# EAGLE design Fog_DRL_Cam (EAGLE 8.2.2)
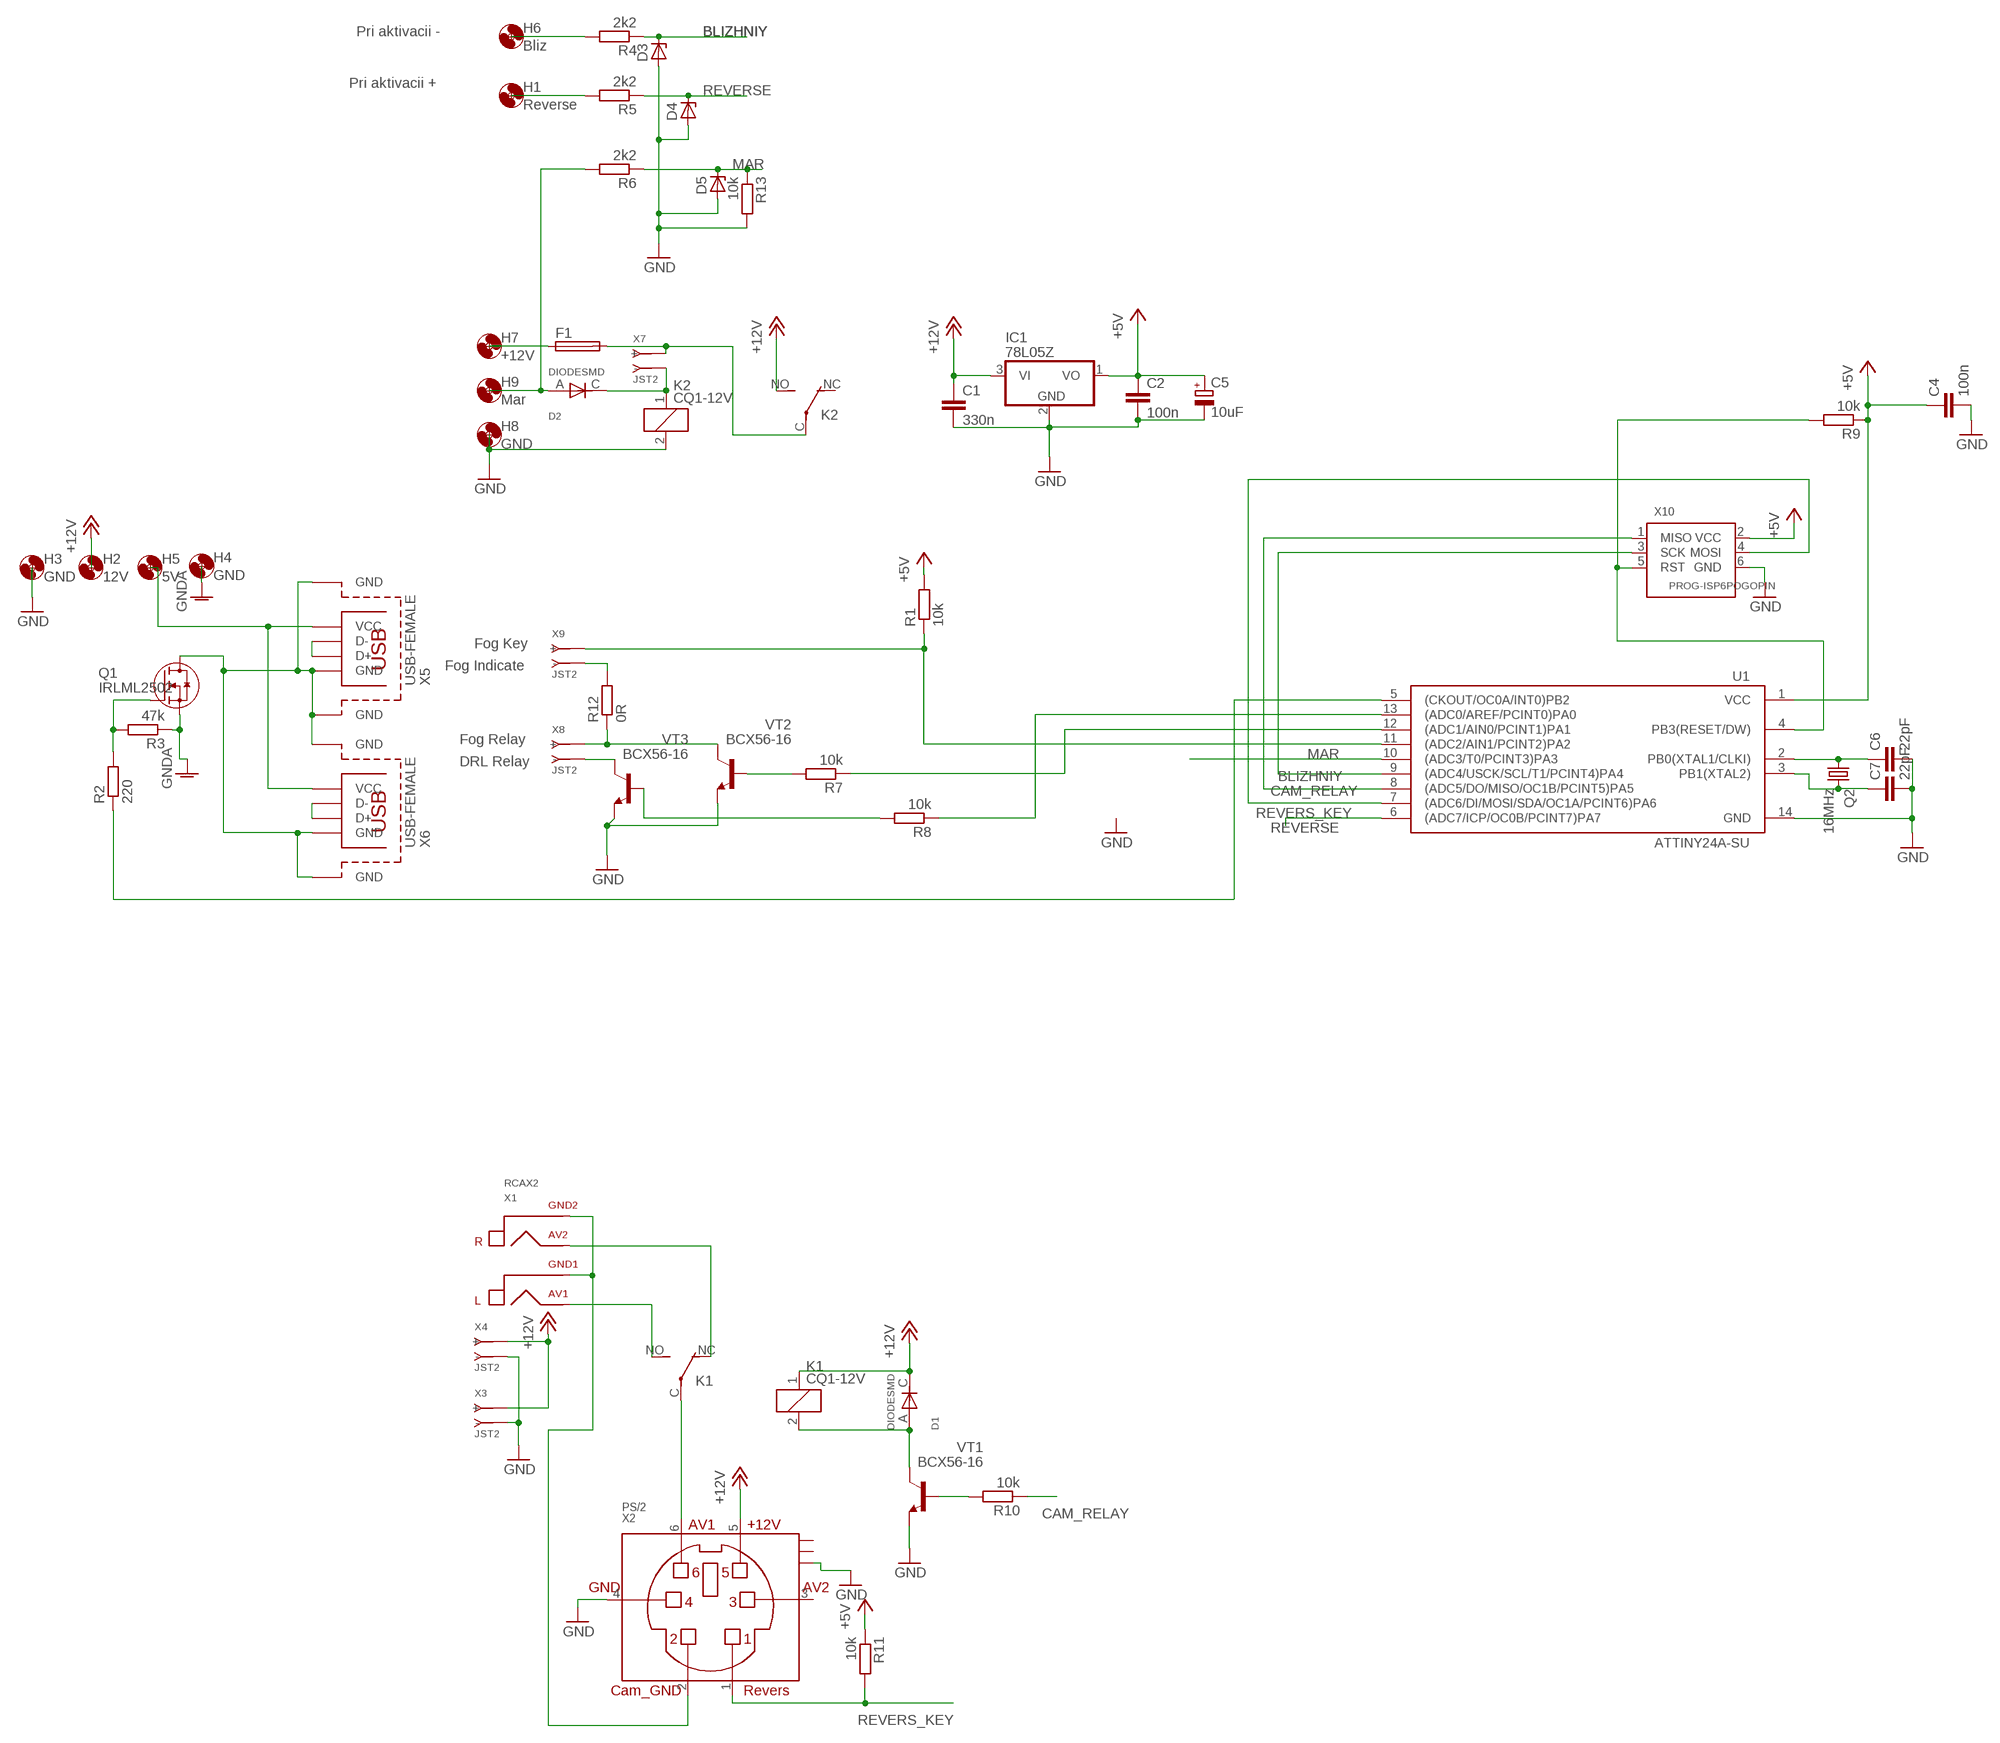
[diagram p0: schematic, sheet 1]

## Parts
C1  330n  C-EUC0805  [C0805]
C2  100n  C-EUC0603  [C0603]
C4  100n  C-EUC0603  [C0603]
C5  10uF  CPOL-EUCT3216  [CT3216]
C6  22pF  C-EUC0603  [C0603]
C7  22pF  C-EUC0603  [C0603]
D1  DIODESMD  [DO214AC]
D2  DIODESMD  [DO214AC]
D3  ZENER-DIODESOD80C  [SOD80C]
D4  ZENER-DIODESOD80C  [SOD80C]
D5  ZENER-DIODESOD80C  [SOD80C]
F1  SH22,5A  [SH22,5A]
H1  Reverse  MOUNT-HOLE2.8  [2,8]
H2  12V  MOUNT-HOLE3.0  [3,0]
H3  GND  MOUNT-HOLE3.0  [3,0]
H4  GND  MOUNT-HOLE3.0  [3,0]
H5  5V  MOUNT-HOLE3.0  [3,0]
H6  Bliz  MOUNT-HOLE2.8  [2,8]
H7  +12V  MOUNT-HOLE3.0  [3,0]
H8  GND  MOUNT-HOLE3.0  [3,0]
H9  Mar  MOUNT-HOLE2.8  [2,8]
IC1  78L05Z  [TO92]
K1  CQ1-12V  [CQ1]
K2  CQ1-12V  [CQ1]
Q1  IRLML2502  SI2302  [SOT-23-GSD]
Q2  16MHz  CRYSTALHC49UP  [HC49UP]
R1  10k  R-EU_R0603  [R0603]
R2  220  R-EU_R0603  [R0603]
R3  47k  R-EU_R0603  [R0603]
R4  2k2  R-EU_R0603  [R0603]
R5  2k2  R-EU_R0603  [R0603]
R6  2k2  R-EU_R0603  [R0603]
R7  10k  R-EU_R0603  [R0603]
R8  10k  R-EU_R0603  [R0603]
R9  10k  R-EU_R0603  [R0603]
R10  10k  R-EU_R0603  [R0603]
R11  10k  R-EU_R0603  [R0603]
R12  0R  R-EU_R0603  [R0603]
R13  10k  R-EU_R0603  [R0603]
U1  ATTINY24A-SU  [SO14]
VT1  BCX56-16  [SOT89-BCE]
VT2  BCX56-16  [SOT89-BCE]
VT3  BCX56-16  [SOT89-BCE]
X1  RCAX2  [RCAX2]
X2  PS/2  [PS/2]
X3  JST2  [JST*2]
X4  JST2  [JST*2]
X5  USB-FEMALE  [USB-FEMALE]
X6  USB-FEMALE  [USB-FEMALE]
X7  JST2  [JST*2]
X8  JST2  [JST*2]
X9  JST2  [JST*2]
X10  PROG-ISP6POGOPIN  [PROG_POGOPIN]

## Nets
+5V: C2.1 C4.1 C5.+ IC1.1(VO) R1.2 R9.1 R11.1 U1.1(VCC) X10.2(VCC)
+12V: C1.1 D1.C(KATOD) H2.P$1 IC1.3(VI) K1.1 K2.NO(2:S) X2.5 X3.1(+) X4.1(+)
BLIZHNIY: D3.C R4.1 U1.9((ADC4/USCK/SCL/T1/PCINT4)PA4) X10.3(SCK)
CAM_RELAY: R10.1 U1.8((ADC5/DO/MISO/OC1B/PCINT5)PA5) X10.1(MISO)
GND: C1.2 C2.2 C4.2 C5.- C6.2 C7.2 D3.A D4.A D5.A H3.P$1 H8.P$1 IC1.2(GND) K2.2 R13.2 U1.14(GND) VT1.E VT2.E VT3.E X2.4 X2.GND0 X3.2(-) X4.2(-) X10.6(GND)
GNDA: H4.P$1 Q1.S R3.1
MAR: D5.C R6.1 R13.1 U1.10((ADC3/T0/PCINT3)PA3)
N$1: K1.NO(2:S) X1.AV1
N$2: R12.2 X9.2(-)
N$3: X1.GND1 X1.GND2 X2.2
N$4: K1.C(2:P) X2.6
N$5: D1.A(ANOD) K1.2 VT1.C VT1.C@1(C)
N$6: F1.1 H7.P$1
N$7: H5.P$1 X5.VCC X6.VCC
N$8: Q1.D X5.GND X5.GND@1(GND) X5.GND@2(GND) X6.GND X6.GND@1(GND) X6.GND@2(GND)
N$9: X5.D+ X5.D-
N$10: X6.D+ X6.D-
N$11: F1.2 K2.C(2:P) X7.1(+)
N$12: D2.C(KATOD) K2.1 X7.2(-)
N$13: D2.A(ANOD) H9.P$1 R6.2
N$14: R2.1 U1.5((CKOUT/OC0A/INT0)PB2)
N$15: VT3.C VT3.C@1(C) X8.2(-)
N$16: R12.1 VT2.C VT2.C@1(C) X8.1(+)
N$17: R8.1 U1.13((ADC0/AREF/PCINT0)PA0)
N$18: R7.1 U1.12((ADC1/AIN0/PCINT1)PA1)
N$19: R1.1 U1.11((ADC2/AIN1/PCINT2)PA2) X9.1(+)
N$20: Q1.G R2.2 R3.2
N$21: H1.P$1 R5.2
N$22: H6.P$1 R4.2
N$25: R7.2 VT2.B
N$26: R8.2 VT3.B
N$27: C6.1 Q2.1 U1.2(PB0(XTAL1/CLKI))
N$28: R10.2 VT1.B
N$31: K1.NC(2:O) X1.AV2
N$38: R9.2 U1.4(PB3(RESET/DW)) X10.5(RST)
N$39: C7.1 Q2.2 U1.3(PB1(XTAL2))
REVERS_KEY: R11.2 U1.7((ADC6/DI/MOSI/SDA/OC1A/PCINT6)PA6) X2.1 X10.4(MOSI)
REVERSE: D4.C R5.1 U1.6((ADC7/ICP/OC0B/PCINT7)PA7)
Unconnected: K2.NC(2:O) X2.3 X2.GND1 X2.GND2

## Notes on the sheet
- Pri aktivacii -
- Pri aktivacii +
- Fog Key
- Fog Indicate
- Fog Relay
- DRL Relay

## Library data of the parts
C1 C2 C4 C6 C7 = rcl:C-EU: CAPACITOR, European symbol
C5 = rcl:CPOL-EU: POLARIZED CAPACITOR, European symbol
D1 D2 = usb:DIODE: DIODE
D3-D5 = diode:ZENER-DIODE: Z-Diode
F1 = fuse:SH22,5A: FUSE HOLDER grid 22,5mm, isolated cap OGN0031 8201, Schurter (Buerklin); MPN: 0031.7701.11; OC_FARNELL: unknown; OC_NEWARK: 04F1224
H1-H9 = holes:MOUNT-HOLE: MOUNTING HOLE with drill center marker
IC1 = linear:78*: Positive VOLTAGE REGULATOR Source: http://cache.national.com/ds/LM/LM78L05.pdf http://www.fairchildsemi.com/ds/LM/LM7805.pdf
K1 K2 = relay:CQ1-12V: AUTOMOTIVE QUIET RELAY NAiS Source: http://www.mew-europe.com/.. en_ds_61208_0000.pdf; OC_FARNELL: unknown; OC_NEWARK: unknown
Q1 = usb:SI2302: N-канальный полевик
Q2 = crystal:CRYSTAL: CRYSTAL; OC_FARNELL: unknown; OC_NEWARK: unknown
R1-R13 = rcl:R-EU_: RESISTOR, European symbol
U1 = usb:ATTINY24A: ATTiny24A ATTiny44A ATTiny84A
VT1-VT3 = usb:BCX56-16
X1 = usb:RCAX2
X2 = usb:PS/2: MINI DIN JACK DIP 90° WITH SHIELD
X3 X4 X7-X9 = usb:JST*2
X5 X6 = usb:USB: USB Port
X10 = usb:PROG-ISP

## Board
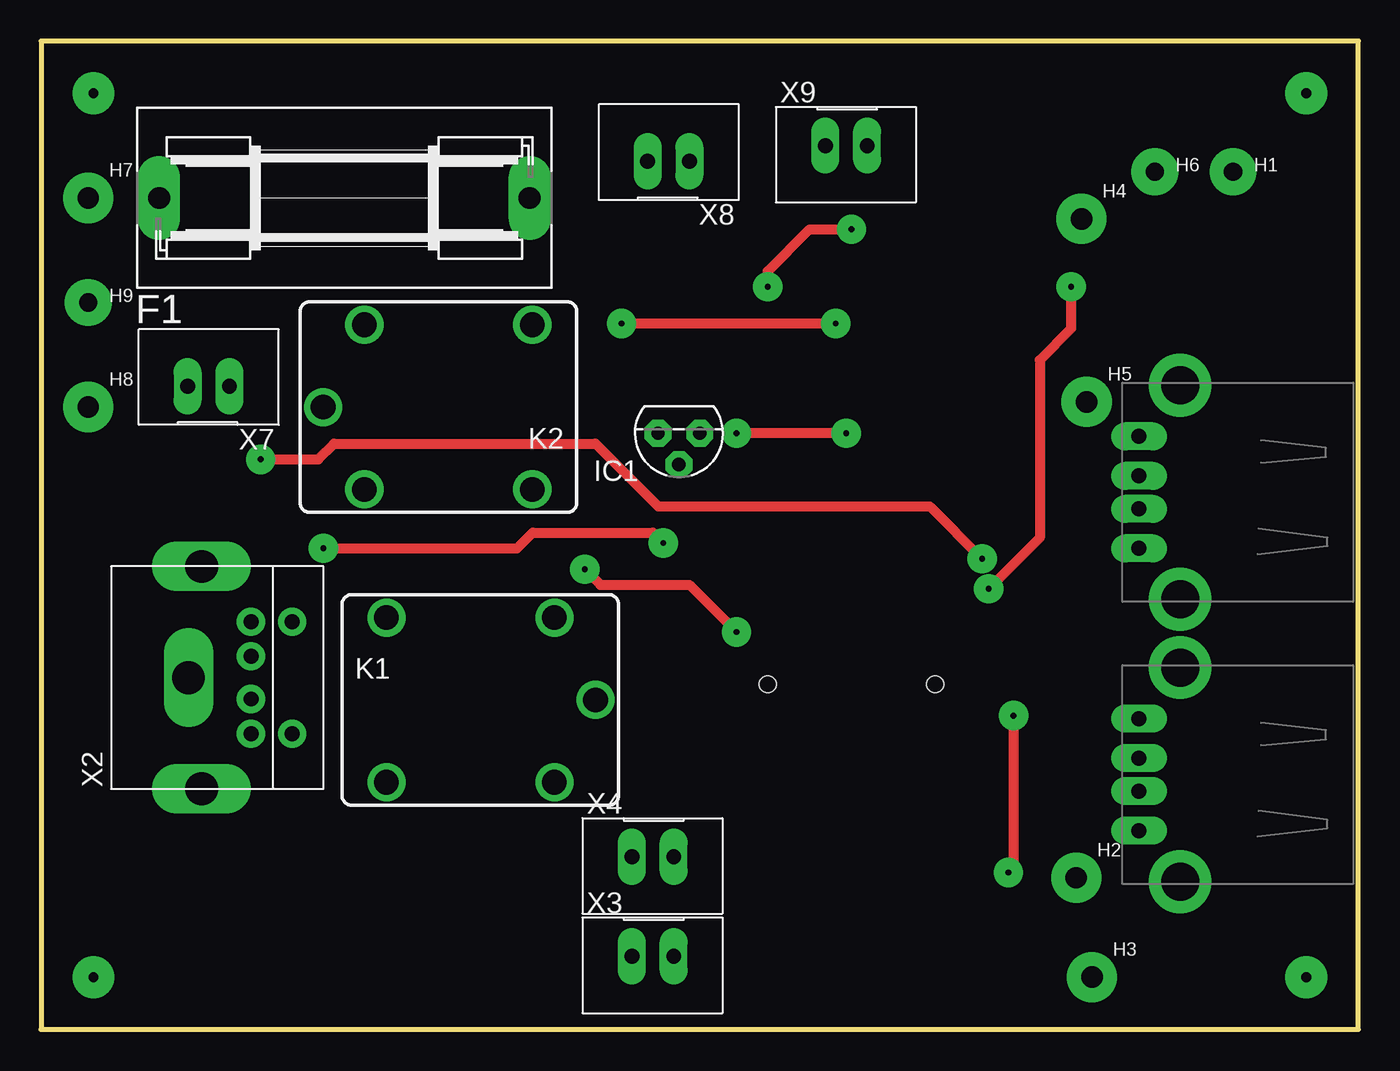
[diagram p1: board, top side]
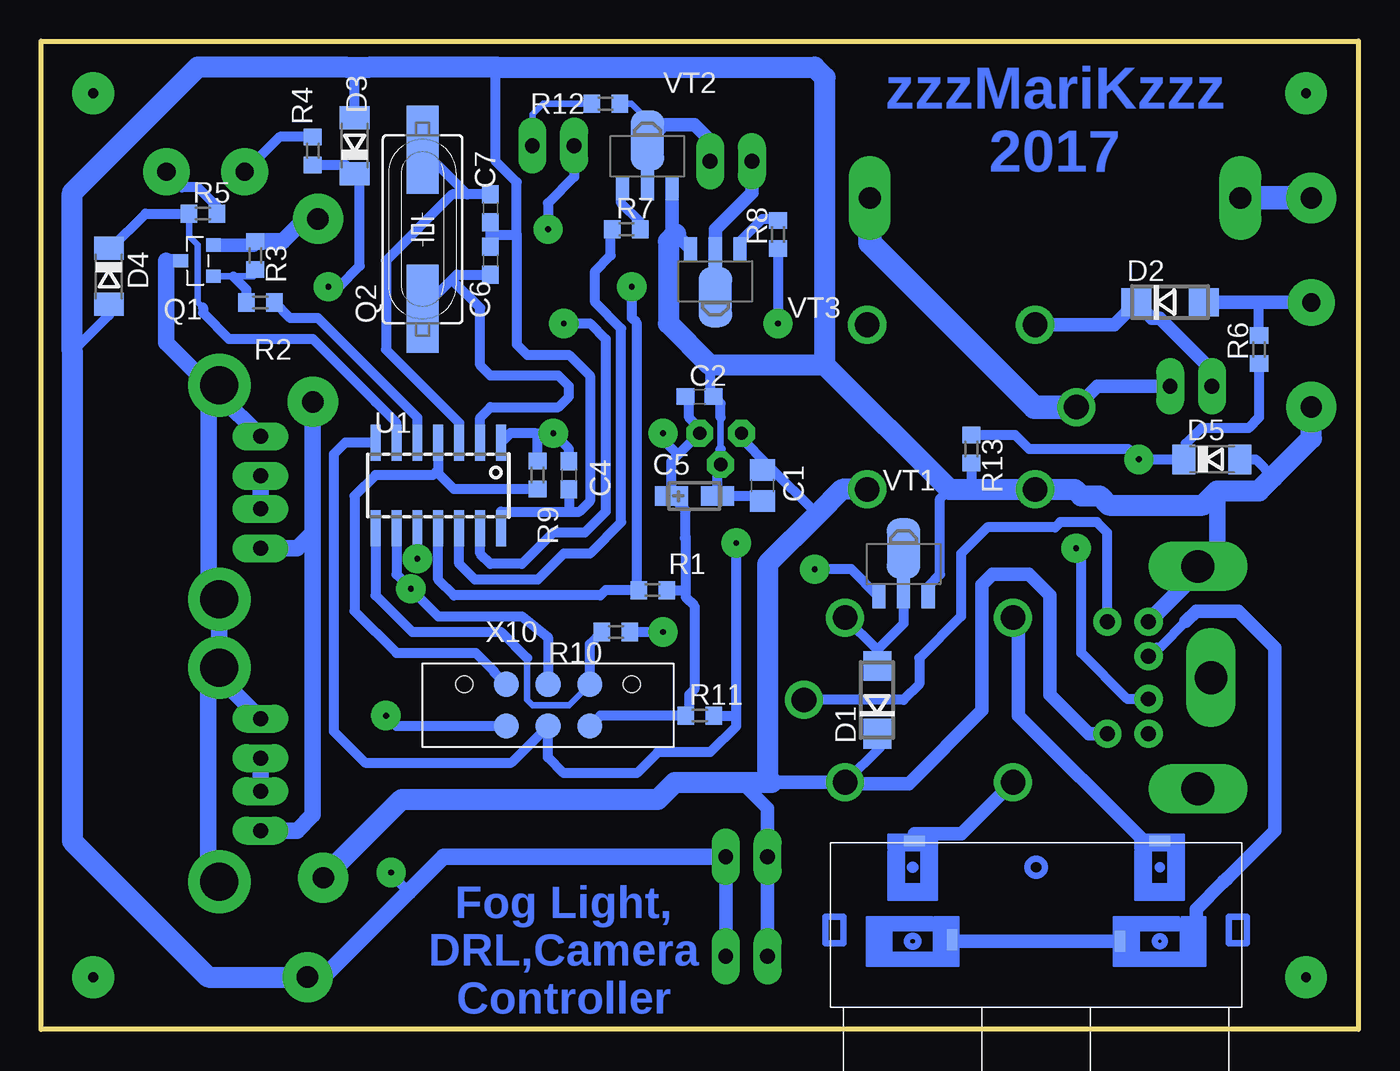
[diagram p2: board, bottom side, seen from below]

Size 80 x 60 mm. Coordinates in mm from the lower left corner, seen from the top.
Outline: 0,0 80,0 80,60 0,60 0,0
Copper layers (1*16): Top 0.035mm / dielectric 1.5mm / Bottom 0.035mm
Design rules "default": minimum track width 12mil, minimum drill 32mil, track to track 12mil, track to pad 12mil, pad to pad 12mil, via to via 12mil, smd to smd 8mil, copper to edge 40mil, drill to drill 8mil, minimum pad ring 16mil, minimum via ring 12mil, stop-mask expansion 4mil, vias tented up to drill 0mil, thermal gap 20mil

### Footprints (pad centres in the part's own frame; a part is rotated, then mirrored left to right if it is on the bottom)
C0805 = smd 1.3 x 1.5: 1 -0.95,0; 2 0.95,0
C0603 = smd 1.1 x 1: 1 -0.85,0; 2 0.85,0
CT3216 = smd 2 x 1.2: + -1.4,0; - 1.4,0
DO214AC = smd 1.8 x 1.7: A 2.05,0; C -2.05,0
SOD80C = smd 1.4 x 1.8: A 1.7,0; C -1.7,0
SH22,5A = drill 1.321 pad 2.54 long: 1 -11.252,0; 2 11.252,0
2,8 = drill 1.1 pad 2.845: P$1 0,0
3,0 = drill 1.3 pad 3.048: P$1 0,0
TO92 = drill 0.813 octagon: 1 -1.27,0; 2 0,1.905; 3 1.27,0
CQ1 = drill 1.5: 1 4.5,-5; 2 4.5,5; C 7,0; NC -5.7,-5; NO -5.7,5
SOT-23-GSD = smd 0.8 x 0.9: D 0,2; G -0.95,0; S 0.95,0
HC49UP = smd 5.334 x 1.93: 1 -4.826,0; 2 4.826,0
R0603 = smd 1 x 1.1: 1 -0.85,0; 2 0.85,0
SO14 = smd 0.6 x 2.2: 1 -3.81,-2.6; 2 -2.54,-2.6; 3 -1.27,-2.6; 4 0,-2.6; 5 1.27,-2.6; 6 2.54,-2.6; 7 3.81,-2.6; 8 3.81,2.6; 9 2.54,2.6; 10 1.27,2.6; 11 0,2.6; 12 -1.27,2.6; 13 -2.54,2.6; 14 -3.81,2.6
SOT89-BCE = smd 0.8 x 1.4: B -1.499,-1.981; E 1.499,-1.981 | smd 0.8 x 1.9: C 0,-1.727 | smd 2.032 x 3.65: C@1 0,0.94
RCAX2 = smd 1.27 x 0.635: AV1 0,-1.6; AV2 14.9,-1.6 | smd 0.635 x 1.27: GND1 2.4,4.5; GND2 12.6,4.4
PS/2 = drill 0.9: 1 5.45,4.4; 2 8.05,4.4; 3 3.35,4.4; 4 10.15,4.4; 5 3.35,1.9; 6 10.15,1.9 | drill 2 long: GND0 13.5,7.4; GND1 0,7.4; GND2 6.75,8.2
JST*2 = drill 0.9 long: 1 0,0; 2 2.54,0
USB-FEMALE = drill 0.9 long: D+ 4.4,0; D- 2.4,0; GND 6.8,0; VCC 0,0 | drill 2.3 pad 3.81: GND@1 -3.1,-2.5; GND@2 9.9,-2.5
PROG_POGOPIN = smd 1.524 x 1.524: 1 0,7.62; 2 2.54,7.62; 3 0,5.08; 4 2.54,5.08; 5 0,2.54; 6 2.54,2.54 | hole 1.016: 0,0; 0,10.16

### Placement (x,y rotation side)
C1  36.2,33.02 270 bottom
C2  40.01,38.42 0 bottom
C4  47.94,33.66 270 bottom
C5  40.32,32.38 0 bottom
C6  52.7,46.67 90 bottom
C7  52.7,49.85 270 bottom
D1  29.21,20 90 bottom
D2  11.43,44.13 0 bottom
D3  60.96,53.66 90 bottom
D4  75.88,45.72 270 bottom
D5  8.89,34.61 0 bottom
F1  18.41,50.48 0 top
H1  72.39,52.07 0 top
H2  62.87,9.21 0 top
H3  63.82,3.17 0 top
H4  63.18,49.21 0 top
H5  63.5,38.1 0 top
H6  67.63,52.07 0 top
H7  2.86,50.48 0 top
H8  2.86,37.78 0 top
H9  2.86,44.13 0 top
IC1  38.73,36.2 180 top
K1  26.67,20 0 top
K2  24.13,37.78 180 top
Q1  69.53,46.67 90 bottom
Q2  56.83,48.58 90 bottom
R1  42.86,26.67 0 bottom
R2  66.67,44.13 180 bottom
R3  66.99,46.99 270 bottom
R4  63.5,53.34 90 bottom
R5  70.17,49.53 0 bottom
R6  6.03,41.27 90 bottom
R7  44.45,48.58 0 bottom
R8  35.24,48.26 90 bottom
R9  49.85,33.66 270 bottom
R10  45.09,24.13 0 bottom
R11  40.01,19.05 0 bottom
R12  45.72,56.2 180 bottom
R13  23.5,35.24 270 bottom
U1  55.88,33.02 180 bottom
VT1  27.62,28.26 0 bottom
VT2  43.18,53.02 0 bottom
VT3  39.05,45.4 180 bottom
X1  12.06,9.84 180 bottom
X2  17.14,14.61 90 top
X3  35.88,4.45 0 top
X4  35.88,10.48 0 top
X5  66.67,12.06 90 top
X6  66.67,29.21 90 top
X7  11.43,39.05 180 top
X8  39.37,52.7 180 top
X9  47.62,53.66 0 top
X10  54.29,20.95 270 bottom

### Tracks (layer width: path | path; a pad name or v marks a point on that pad's centre or on a via)
+5V  (via drill 0.35 pad 1.78)
  Top 0.61: v48.9,36.2 v42.23,36.2
  Bottom 0.61: C2.1 40.64,38.2 40.64,37.15 40.01,36.51 IC1.1 41.32,34.88 | C5.+ 41.72,34.48 41.32,34.88 | C5.+ 41.72,32.26 | 50.03,36.2 51.49,36.2 U1.1 | 50.03,36.2 v48.9,36.2 47.94,35.24 C4.1 | R9.1 49.85,36.02 50.03,36.2 | 40.96,19.05 46.04,19.05 X10.2 | 40.96,19.05 R11.1 | 40.85,29.9 40.85,26.62 | 40.85,29.9 40.85,31.52 C5.+ | v42.23,36.2 42.23,35.79 41.32,34.88 | 40.91,29.84 40.85,29.9 | R1.2 40.9,26.67 40.85,26.62 | 40.85,26.62 40.85,26.25 40.32,25.72 40.32,20.64 40.64,20.32 40.64,19.37 40.96,19.05
+12V
  Bottom 0.61: 29.04,17.78 29.04,17.14 K1.1 | IC1.3 37.47,35.88 35.88,34.29 | 35.88,34.29 32.86,31.27 | C1.1 35.88,34.29
  Bottom 0.813: 35.88,15.24 35.64,15 K1.1 31.09,14.92 27.3,14.92 22.86,19.37 22.86,26.99 22.23,27.62 20,27.62 18.73,26.35 18.73,20.32 16.37,17.95 X2.5 | 29.04,17.78 D1.C | X3.1 X4.1 35.88,13.41 37.47,15
  Bottom 1.27: K2.NO 31.35,32.78 32.86,31.27 35.88,28.26 35.88,15.24 | 35.64,15 37.47,15 41.51,15 42.55,13.97 58.1,13.97 H2.P$1
BLIZHNIY  (via drill 0.35 pad 1.78)
  Top 0.61: v62.55,45.09 62.55,42.55 60.64,40.64 60.64,29.84 v57.55,26.75
  Bottom 0.61: U1.9 58.42,27.62 v57.55,26.75 55.88,25.08 50.8,25.08 49.21,23.81 X10.3 | R4.1 61.49,52.49 D3.C 60.64,51.64 60.64,46.35 61.91,45.09 v62.55,45.09
CAM_RELAY
  Bottom 0.406: 50.48,22.54 50.48,20 50.16,19.68 47.94,19.68 X10.1
  Bottom 0.61: U1.8 59.69,26.35 57.47,24.13 52.07,24.13 50.48,22.54 | X10.1 46.67,23.39 R10.1
GND  (via drill 0.35 pad 1.78)
  Top 0.61: v59.05,19.05 59.05,9.84 v58.74,9.53
  Bottom 0.406: 38.73,35.24 38.73,37.15
  Bottom 0.61: 38.73,35.24 IC1.2 38.92,34.1 C5.- 36.51,32.38 C1.2 | 38.73,37.15 38.73,38 C2.2 39.37,38.63 39.37,40.32 | U1.14 52.07,31.43 47.76,31.43 | C4.2 47.94,31.62 47.76,31.43 | 47.76,31.43 47.31,31.43 46.67,32.07 46.67,39.69 47.94,40.96 50.48,40.96 51.12,41.59 51.12,48.26 | X10.6 58.42,18.41 v59.05,19.05 | v58.74,9.53 58.74,9.44 57.67,8.37 | 60.01,58.42 | D4.A 75.88,43.35 78.11,41.13 | D3.A 60.96,57.88 61.5,58.42 | C6.2 52.7,48.26 | 52.7,48.26 C7.2 | 52.7,48.26 51.12,48.26 | 51.12,48.26 51.12,51.44 52.39,52.7 52.39,58.35 52.32,58.42 | D5.A 6.24,34.61 5.18,33.55 | R13.2 23.5,33.02 23.73,32.78 | VT1.E 26.12,26.9 25.4,27.62 25.4,32.23 24.84,32.78
  Bottom 0.813: VT2.E 41.68,48.51 41.46,48.3 VT3.E | X3.2 X4.2 | 53.02,58.42
  Bottom 1.016: 8.57,32.7 8.57,29.28 X2.GND0 9.74,27.75 X2.4 | X4.2 55.56,10.48 57.67,8.37 62.87,3.17 H3.P$1
  Bottom 1.27: 3.49,37.78 H8.P$1 2.86,35.88 5.18,33.55 6.03,32.7 8.57,32.7 9.44,31.84 15.15,31.84 15.7,32.38 16.83,32.38 17.23,32.78 K2.2 | 19.55,32.7 K2.2 | K2.2 23.73,32.78 24.84,32.78 32.38,40.32 | 32.38,40.32 39.37,40.32 41.91,42.86 41.91,47.85 41.46,48.3 | 32.38,40.32 32.38,57.78 33.02,58.42 52.32,58.42 53.02,58.42 60.01,58.42 61.5,58.42 70.48,58.42 78.11,50.8 78.11,41.13 78.11,11.43 69.85,3.17 H3.P$1
GNDA
  Bottom 0.406: 67.09,47.62 R3.1
  Bottom 0.813: 67.09,47.62 Q1.S
  Bottom 1.016: R3.1 65.33,47.84 63.95,49.21 H4.P$1
MAR  (via drill 0.35 pad 1.78)
  Top 0.61: v13.34,34.61 16.83,34.61 17.78,35.56 33.66,35.56 37.47,31.75 53.98,31.75 v57.15,28.57
  Bottom 0.61: R6.1 6.03,37.15 6.67,36.51 9.53,36.51 10.48,35.56 10.48,34.72 D5.C v13.34,34.61 13.97,35.24 20,35.24 20.85,36.09 R13.1 | v57.15,28.57 U1.10
N$1
  Bottom 0.813: K1.NO 20.64,24.67 20.64,19.05 13.03,11.44 X1.AV1
N$2
  Bottom 0.406: R12.2 49.53,56.2 50.16,55.56 X9.2
N$3
  Bottom 0.61: 10.48,24.77 12.06,23.18 12.22,23.18 X2.2
  Bottom 0.813: 10.48,24.77 9.84,25.4 7.3,25.4 5.08,23.18 5.08,12.06 7.94,9.21 8.26,8.89 9.84,7.3 9.84,6.35 14.29,6.35 14.46,6.17 X1.GND1 24.57,5.34 X1.GND2
N$4
  Bottom 0.61: K1.C 27.62,20 26.67,20.95 26.67,22.54 24.13,25.08 24.13,28.89 22.54,30.48 18.41,30.48 18.1,30.8 15.88,30.8 15.24,30.17 X2.6
N$5
  Bottom 0.61: 28.72,22.54 D1.A 29.21,23.04 | 29.21,23.04 K1.2 | 29.21,23.04 27.62,24.63 VT1.C VT1.C@1
N$6
  Bottom 1.422: H7.P$1 F1.1
N$7
  Bottom 1.016: H5.P$1 63.5,30.48 63.5,30.16 | 63.5,30.16 64.45,29.21 X6.VCC | X5.VCC 64.45,12.06 63.5,13.02 63.5,30.16
N$8
  Bottom 0.813: Q1.D 72.39,46.67
  Bottom 1.016: 72.39,46.67 72.39,41.69 69.81,39.11 | 69.81,39.11 X6.GND@2 69.17,38.51 X6.GND | 69.81,39.11 69.81,26.75 X6.GND@1 X5.GND@2 69.47,21.96 69.69,21.75 | X5.GND@1 69.85,9.64 69.85,21.59 69.69,21.75 | X5.GND 69.56,21.75 69.69,21.75
N$9
  Bottom 1.016: X5.D- X5.D+
N$10
  Bottom 1.016: X6.D- X6.D+
N$11
  Bottom 0.813: X7.1 15.86,39.05 K2.C
  Bottom 1.422: F1.2 29.67,47.77 19.68,37.78 K2.C
N$12
  Bottom 0.813: K2.1 14.83,42.78 D2.C 12.53,43.18 12.06,43.18 8.89,40.01 X7.2
N$13
  Bottom 0.61: R6.2 6.03,43.83 6.34,44.13
  Bottom 0.813: D2.A 6.34,44.13 H9.P$1
N$14
  Bottom 0.61: U1.5 57.15,37.15 63.18,43.18 64.87,43.18 R2.1
N$15
  Bottom 0.406: VT3.C VT3.C@1
  Bottom 0.813: VT3.C 39.05,48.58 36.83,50.8 X8.2
N$16
  Bottom 0.406: R12.1 44.13,56.2 42.54,54.6
  Bottom 0.61: VT2.C@1 VT2.C
  Bottom 0.813: X8.1 39.37,53.98 40.32,54.93 42.22,54.93 42.54,54.6 VT2.C@1
N$17  (via drill 0.35 pad 1.78)
  Top 0.61: v35.24,42.86 v48.26,42.86
  Bottom 0.61: U1.13 53.34,28.89 52.7,28.26 50.8,28.26 48.9,30.16 46.99,30.16 45.72,31.43 45.72,41.91 46.67,42.86 v48.26,42.86 | R8.1 v35.24,42.86
N$18
  Bottom 0.61: U1.12 54.61,28.26 53.66,27.3 49.85,27.3 48.26,28.89 46.67,28.89 44.77,30.8 44.77,42.55 46.35,44.13 46.35,46.04 45.4,46.99 45.4,48.48 R7.1
N$19  (via drill 0.35 pad 1.78)
  Top 0.61: v49.21,48.58 46.67,48.58 44.13,46.04 v44.13,45.09
  Bottom 0.61: U1.11 55.88,27.3 54.93,26.35 46.04,26.35 45.72,26.67 R1.1 43.85,26.81 43.85,42.92 44.13,43.2 v44.13,45.09 | X9.1 47.62,51.75 49.21,50.16 v49.21,48.58
N$20
  Bottom 0.406: Q1.G 68.33,45.72 67.09,45.72 R3.2
  Bottom 0.61: R2.2 67.53,44.92 68.33,45.72
N$21
  Bottom 0.61: R5.2 69.32,49.95 70.48,51.12 71.44,51.12 H1.P$1
N$22
  Bottom 0.61: R4.2 65.51,54.19 H6.P$1
N$25
  Bottom 0.61: R7.2 43.6,49 44.77,50.16 44.77,50.95 VT2.B
N$26
  Bottom 0.61: VT3.B 37.55,47.85 36.2,49.21 35.34,49.21 R8.2
N$27
  Bottom 0.61: C6.1 54.76,45.82 55.06,45.52 | 55.06,45.52 Q2.1 | U1.2 53.34,37.15 52.7,37.78 48.58,37.78 47.94,38.42 47.94,39.05 48.58,39.69 52.7,39.69 53.34,40.32 53.34,43.8 55.06,45.52
N$28  (via drill 0.35 pad 1.78)
  Top 0.61: v33.02,27.94 33.97,26.99 39.37,26.99 v42.23,24.13
  Bottom 0.61: R10.2 v42.23,24.13 | VT1.B 29.13,26.28 30.8,27.94 v33.02,27.94
N$31
  Bottom 0.813: X1.AV2 26.96,11.87 24.11,11.87 K1.NC
N$32  (via drill 0.6 pad 2.54)
  other vias: 3.17,56.83
N$33  (via drill 0.6 pad 2.54)
  other vias: 3.17,3.17
N$34  (via drill 0.6 pad 2.54)
  other vias: 76.83,3.17
N$35  (via drill 0.6 pad 2.54)
  other vias: 76.83,56.83
N$38
  Bottom 0.61: U1.4 55.88,33.97 55.98,33.87 | 55.98,33.87 56.2,33.66 59.69,33.66 60.96,32.38 60.96,25.4 58.42,22.86 53.61,22.86 52.46,21.71 52.46,21.67 X10.5 | R9.2 54.92,32.8 55.98,33.87
N$39
  Bottom 0.61: C7.1 54.13,50.7 | 54.13,50.7 Q2.2 | 54.13,50.7 55.03,50.7 59.05,46.67 59.05,41.27 54.61,36.83 U1.3
REVERS_KEY  (via drill 0.35 pad 1.78)
  Top 0.61: v17.14,29.21 28.89,29.21 29.84,30.16 37.15,30.16 v37.78,29.53
  Bottom 0.61: U1.7 61.53,35.62 62.23,34.92 62.23,18.1 60.33,16.19 51.44,16.19 X10.4 49.21,16.51 48.26,15.56 43.81,15.56 42.55,16.83 39.37,16.83 37.78,18.41 37.78,18.9 | X2.1 14.02,20.05 16.83,22.86 16.83,28.89 v17.14,29.21 | R11.2 37.93,19.05 37.78,18.9 | 37.78,18.9 v37.78,29.53
REVERSE
  Bottom 0.406: R5.1 71.02,48.16 70.48,47.62 70.48,44.13 70.17,43.81
  Bottom 0.61: D4.C 75.77,47.42 73.66,49.53 R5.1 | 70.17,43.81 70.17,43.5 68.58,41.91 63.5,41.91 63.49,41.91 59.69,38.11 59.69,38.1 58.42,36.83 U1.6

### Text on the board
Bottom: zzzMariKzzz / 2017 | Fog Light, / DRL,Camera / Controller